# EAGLE design EGB240_Transistor_75x50mm (EAGLE 7.5.0)
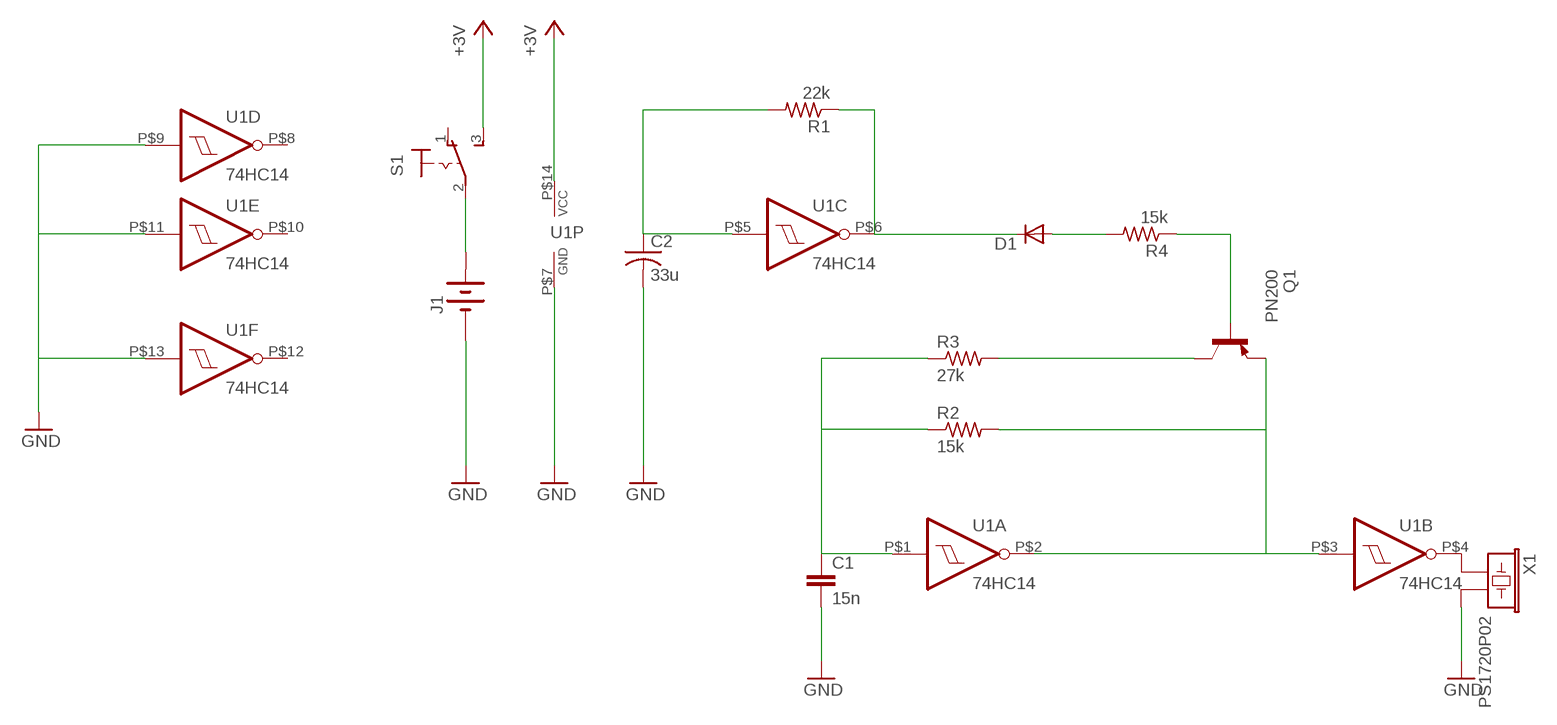
[diagram p0: schematic, sheet 1]

## Parts
C1  15n  CAPCERAMIC-DISC  [CAP-DISC-P5.08]
C2  33u  CAP-POLRB-D5.0XP2.0  [CAP-RB-P2.0-D5.0]
D1  DIODE-DO35DO35-P2.54  [DO35-P2.54]
J1  BATTERY-3VBATT  [BATT-3V]
Q1  PN200  2N4126  [TO92-CBE]
R1  22k  RESISTOR-AXIALVERTICAL  [AXIAL-P2.54]
R2  15k  RESISTOR-AXIALVERTICAL  [AXIAL-P2.54]
R3  27k  RESISTOR-AXIALVERTICAL  [AXIAL-P2.54]
R4  15k  RESISTOR-AXIALHORIZONTAL  [AXIAL-P10.16]
S1  SWITCH-SPDT  [SS-12]
U1  74HC14  [DIP-14]
X1  PS1720P02  BUZZER-PIEZOPS1720P02  [PS1720P02]

## Nets
+3V: S1.3(S) U1.P$14(P:VCC)
GND: C1.P$2 C2.P$2 J1.P$2(-) U1.P$7(P:GND) U1.P$9(D:I) U1.P$11(E:I) U1.P$13(F:I) X1.P$2
N$1: C2.P$1 R1.P$2 U1.P$5(C:I)
N$2: D1.K R1.P$1 U1.P$6(C:O)
N$3: D1.A R4.P$2
N$4: Q1.B R4.P$1
N$5: Q1.C R3.P$2
N$6: C1.P$1 R2.P$1 R3.P$1 U1.P$1(A:I)
N$7: Q1.E R2.P$2 U1.P$2(A:O) U1.P$3(B:I)
N$8: J1.P$1(+) S1.2(P)
N$9: U1.P$4(B:O) X1.P$1
Unconnected: S1.1(O) U1.P$8(D:O) U1.P$10(E:O) U1.P$12(F:O)

## Library data of the parts
C1 = EGB240:CAP: Capacitor, Radial, Non-polarised
C2 = EGB240:CAP-POL: Capacitor, Radial, Polarised
D1 = EGB240:DIODE-DO35: Diode, Axial, DO-35
J1 = EGB240:BATTERY-3V: Battery holder, 3V, 2xAA, flying leads
Q1 = transistor-pnp:2N4126*: PNP Transistror
R1-R4 = EGB240:RESISTOR-AXIAL: Resistor, Axial, 0.25W
S1 = EGB240:SWITCH-SPDT: Switch, SPDT, Slide, On-On
U1 = EGB240:74HC14: Hex schmitt trigger INVERTER
X1 = EGB240:BUZZER-PIEZO

## Module 5V
Ports: 

### Library data of the parts

## Board
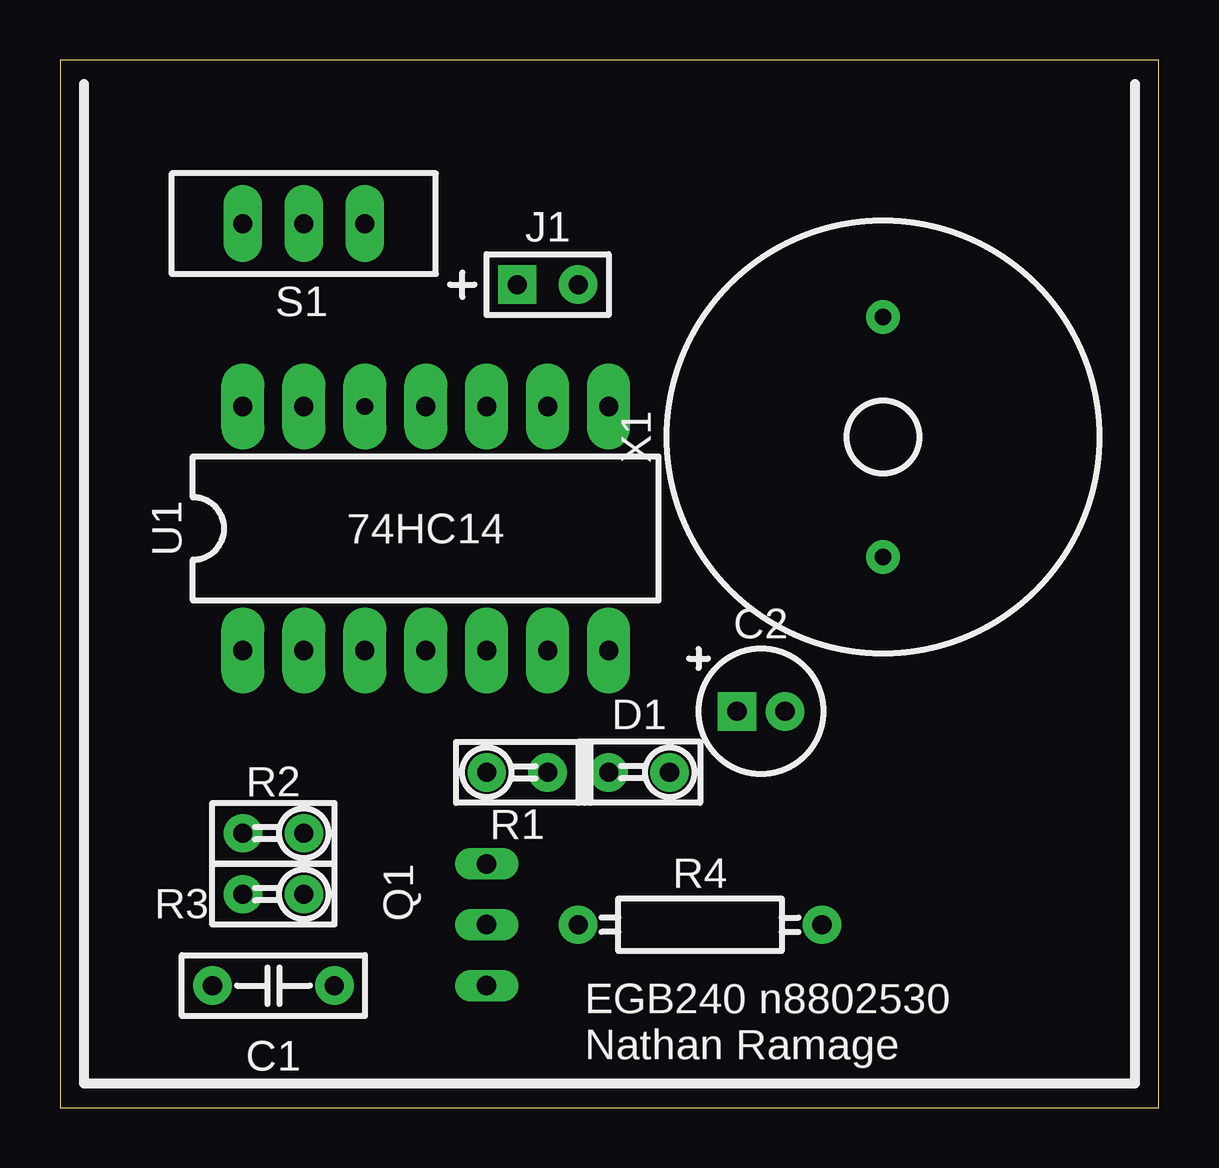
[diagram p1: board, top side]
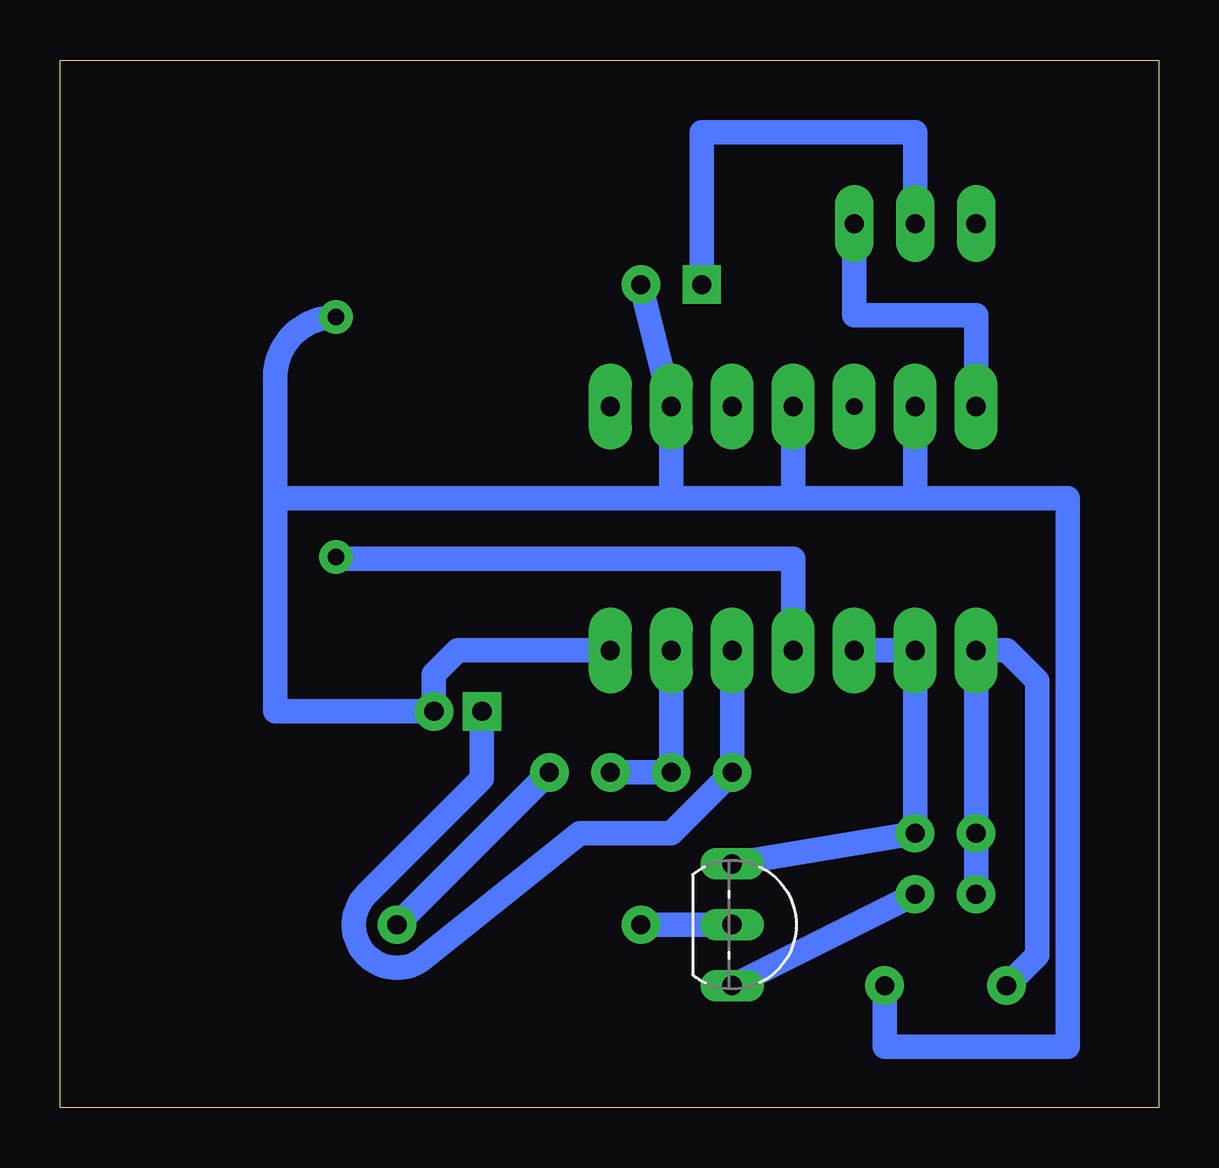
[diagram p2: board, bottom side, seen from below]

Size 45.79 x 43.65 mm. Coordinates in mm from the lower left corner, seen from the top.
Outline: 0,0 45.79,0 45.79,43.65 0,43.65 0,0
Copper layers (1*16): Top 0.035mm / dielectric 1.5mm / Bottom 0.035mm
Design rules "default *": minimum track width 10mil, minimum drill 20mil, track to track 10mil, track to pad 10mil, pad to pad 10mil, via to via 10mil, smd to smd 8mil, copper to edge 1mm, drill to drill 20mil, minimum pad ring 10mil, minimum via ring 8mil, stop-mask expansion 4mil, vias tented up to drill 0mil, thermal gap 10mil
bKeepout: 4 lines

### Footprints (pad centres in the part's own frame; a part is rotated, then mirrored left to right if it is on the bottom)
CAP-DISC-P5.08 = drill 0.8 pad 1.6: P$1 -2.54,0; P$2 2.54,0
CAP-RB-P2.0-D5.0 = drill 0.8 pad 1.6 square: P$1 -1,0 | drill 0.8 pad 1.6: P$2 1,0
DO35-P2.54 = drill 0.8 pad 1.6: A 1.27,0; K -1.27,0
BATT-3V = drill 0.8 pad 1.6 square: P$1 -1.27,0 | drill 0.8 pad 1.6: P$2 1.27,0
TO92-CBE = drill 0.813 long: B 0,0; C 2.54,0; E -2.54,0
AXIAL-P2.54 = drill 0.8 pad 1.6: P$1 -1.27,0; P$2 1.27,0
AXIAL-P10.16 = drill 0.8 pad 1.6: P$1 -5.08,0; P$2 5.08,0
SS-12 = drill 0.8 pad 1.6 long: 1 0,2.54; 2 0,0; 3 0,-2.54
DIP-14 = drill 0.8 pad 1.8 long: P$1 -5.08,7.62; P$2 -5.08,5.08; P$3 -5.08,2.54; P$4 -5.08,0; P$5 -5.08,-2.54; P$6 -5.08,-5.08; P$7 -5.08,-7.62; P$8 5.08,-7.62; P$9 5.08,-5.08; P$10 5.08,-2.54; P$11 5.08,0; P$13 5.08,5.08; P$14 5.08,7.62 | drill 0.7 pad 1.8 long: P$12 5.08,2.54
PS1720P02 = drill 0.7 pad 1.4: P$1 -5,0; P$2 5,0

### Placement (x,y rotation side)
C1  8.89,5.08 0 top
C2  29.21,16.51 0 top
D1  24.13,13.97 0 top
J1  20.32,34.29 0 top
Q1  17.78,7.62 270 bottom
R1  19.05,13.97 180 top
R2  8.89,11.43 0 top
R3  8.89,8.89 0 top
R4  26.67,7.62 0 top
S1  10.16,36.83 90 top
U1  15.24,24.13 90 top
X1  34.29,27.94 90 top

### Tracks (layer width: path | path; a pad name or v marks a point on that pad's centre or on a via)
+3V
  Bottom 1.016: S1.3 12.7,33.02 7.62,33.02 U1.P$14
GND
  Bottom 1.016: J1.P$2 U1.P$9 20.32,25.4 | U1.P$7 29.21,19.05 30.21,18.05 C2.P$2 36.83,16.51 36.83,25.4 | 20.32,25.4 15.24,25.4 | 15.24,25.4 U1.P$11 | 20.32,25.4 36.83,25.4 | 36.83,25.4 36.83,30.4 arc90 X1.P$2 | 15.24,25.4 10.16,25.4 | 10.16,25.4 U1.P$13 | C1.P$2 11.43,2.54 3.81,2.54 3.81,25.4 10.16,25.4
N$1
  Bottom 1.016: U1.P$5 R1.P$2 20.32,11.43 24.13,11.43 30.48,6.35 arc90 33.02,6.35 arc90 33.02,8.89 28.21,13.7 C2.P$1
N$2
  Bottom 1.016: U1.P$6 R1.P$1 D1.K
N$3
  Bottom 1.016: R4.P$2 D1.A
N$4
  Bottom 1.016: R4.P$1 Q1.B
N$5
  Bottom 1.016: Q1.C R3.P$2
N$6
  Bottom 1.016: R3.P$1 R2.P$1 U1.P$1 6.35,19.05 5.08,17.78 5.08,6.35 C1.P$1
N$7
  Bottom 1.016: Q1.E R2.P$2 U1.P$2 U1.P$3
N$8
  Bottom 1.016: S1.2 10.16,40.64 19.05,40.64 J1.P$1
N$9
  Bottom 1.016: U1.P$4 15.24,22.86 34.21,22.86 X1.P$1

### Text on the board
tPlace: EGB240 n8802530 / Nathan Ramage